# EAGLE schematic main_board (EAGLE 9.6.2)
MLX90640 IR camera
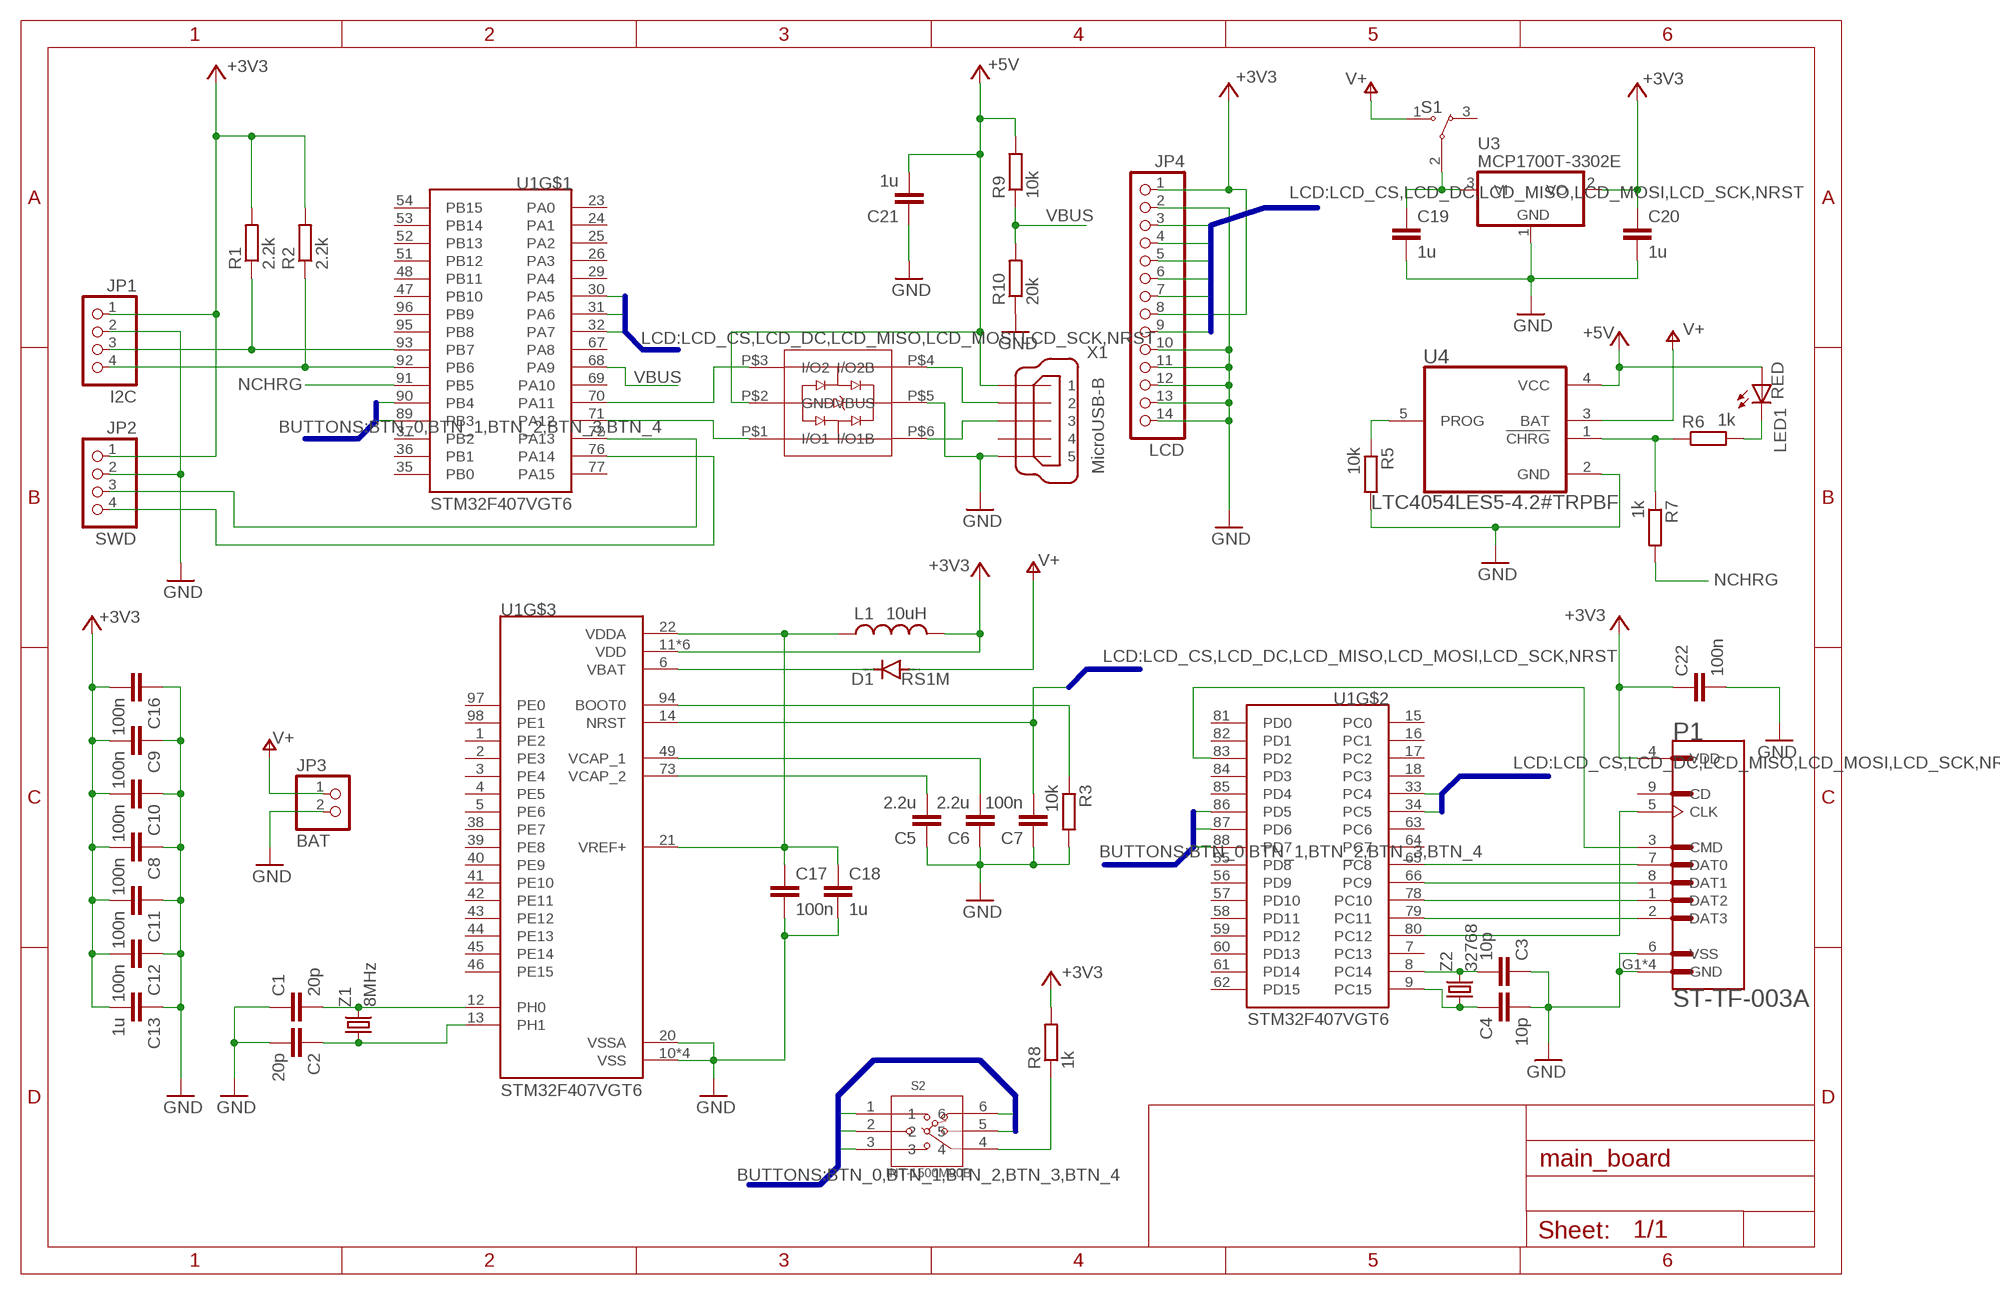
[diagram p0: schematic, sheet 1]

## Parts
C1  20p  C-EUC0805  [C0805]
C2  20p  C-EUC0805  [C0805]
C3  10p  C-EUC0805  [C0805]
C4  10p  C-EUC0805  [C0805]
C5  2.2u  C-EUC0805  [C0805]
C6  2.2u  C-EUC0805  [C0805]
C7  100n  C-EUC0805  [C0805]
C8  100n  C-EUC0805  [C0805]
C9  100n  C-EUC0805  [C0805]
C10  100n  C-EUC0805  [C0805]
C11  100n  C-EUC0805  [C0805]
C12  100n  C-EUC0805  [C0805]
C13  1u  C-EUC0805  [C0805]
C16  100n  C-EUC0805  [C0805]
C17  100n  C-EUC0805  [C0805]
C18  1u  C-EUC0805  [C0805]
C19  1u  C-EUC0805  [C0805]
C20  1u  C-EUC0805  [C0805]
C21  1u  C-EUC0805  [C0805]
C22  100n  C-EUC0805  [C0805]
D1  RS1M  DIODE-DO-214AC  [DO-214AC]
JP1  I2C  PINHD-1X4  [1X04]
JP2  SWD  PINHD-1X4  [1X04]
JP3  BAT  PINHD-1X2  [1X02]
JP4  LCD  PINHD-1X14  [1X14]
L1  10uH  L-USL2012C  [L2012C]
LED1  RED  LEDCHIP-LED0805  [CHIP-LED0805]
P1  ST-TF-003A  [SUNTECH_ST-TF-003A]
R1  2.2k  R-EU_R0805  [R0805]
R2  2.2k  R-EU_R0805  [R0805]
R3  10k  R-EU_R0805  [R0805]
R5  10k  R-EU_R0805  [R0805]
R6  1k  R-EU_R0805  [R0805]
R7  1k  R-EU_R0805  [R0805]
R8  1k  R-EU_R0805  [R0805]
R9  10k  R-EU_R0805  [R0805]
R10  20k  R-EU_R0805  [R0805]
S1  SSA12G  [SW_SSA12G]
S2  INT-1500M90B  SMD-BUTTON(6P-10X10X8.6MM)-SKQUDBE010  [SW6-3.25-10X10X8.6MM]
U1  STM32F407VGT6  [QFP50P1600X1600X160-100N]
U2  USBLC6-2  [SOT-23-6L]
U3  MCP1700T-3302E  MCP1703CB  [SOT23]
U4  LTC4054LES5-4.2#TRPBF  [SOT95P280X100-5N]
X1  MicroUSB-B  MINI-USB-32005-201  [32005-201]
Z1  8MHz  CRYSTALHC49UP  [HC49UP]
Z2  32768  CRYSTALTC38H  [TC38H]

## Nets
+5V [power]: C21.2 LED1.A R9.2 U2.P$2(GND) U4.4(VCC) X1.1
BOOT0: R3.1 U1.94(BOOT0)
BTN_0: S2.6 U1.90(PB4)
BTN_1: S2.1 U1.89(PB3)
BTN_2: S2.5 U1.88(PD7)
BTN_3: S2.3 U1.87(PD6)
BTN_4: S2.2 U1.86(PD5)
BTN_COM: R8.1 S2.4
D+: U2.P$6(I/O1B) X1.3
D+_PROT: U1.71(PA12) U2.P$1(I/O1)
D-: U2.P$4(I/O2B) X1.2
D-_INT: U1.70(PA11) U2.P$3(I/O2)
GND [power]: C1.1 C2.2 C3.1 C4.2 C5.1 C6.1 C7.1 C8.1 C9.1 C10.1 C11.1 C12.1 C13.1 C16.1 C17.2 C18.2 C19.2 C20.2 C21.1 C22.2 JP1.2 JP2.2 JP3.2 JP4.2 JP4.10 JP4.11 JP4.12 JP4.13 JP4.14 P1.6(VSS) P1.G1(GND) P1.G2(GND) P1.G3(GND) P1.G4(GND) R3.2 R5.2 R10.1 U1.10(VSS) U1.20(VSSA) U1.27(VSS) U1.74(VSS) U1.99(VSS) U2.P$5(VBUS) U3.1(GND) U4.2(GND) X1.5
I2C_SCL: JP1.4 R2.1 U1.92(PB6)
I2C_SDA: JP1.3 R1.1 U1.93(PB7)
LCD_CS: JP4.3 U1.33(PC4)
LCD_DC: JP4.5 U1.34(PC5)
LCD_MISO: JP4.9 U1.31(PA6)
LCD_MOSI: JP4.6 U1.32(PA7)
LCD_SCK: JP4.7 U1.30(PA5)
N$1: C1.2 U1.12(PH0) Z1.2
N$2: C2.1 U1.13(PH1) Z1.1
N$3: C4.1 U1.9(PC15) Z2.1
N$5: C6.2 U1.49(VCAP_1)
N$6: C5.2 U1.73(VCAP_2)
N$7: C19.1 S1.2 U3.3(VI)
N$8: R6.1 R7.1 U4.1(!CHRG)
N$9: LED1.C R6.2
N$10: D1.C U1.6(VBAT)
N$11: C3.2 U1.8(PC14) Z2.2
NCHRG: R7.2 U1.91(PB5)
NRST: C7.2 JP4.4 U1.14(NRST)
PROG: R5.1 U4.5(PROG)
SD_CLK: P1.5(CLK) U1.80(PC12)
SD_CMD: P1.3(CMD) U1.83(PD2)
SD_DAT0: P1.7(DAT0) U1.65(PC8)
SD_DAT1: P1.8(DAT1) U1.66(PC9)
SD_DAT2: P1.1(DAT2) U1.78(PC10)
SD_DAT3: P1.2(DAT3) U1.79(PC11)
SWCLK: JP2.4 U1.76(PA14)
SWDIO: JP2.3 U1.72(PA13)
VBAT+ [power]: D1.A JP3.1 S1.1 U4.3(BAT) ; supply symbol labelled V+
VBUS: R9.1 R10.2 U1.68(PA9)
VDD [power]: C8.2 C9.2 C10.2 C11.2 C12.2 C13.2 C16.2 C20.1 C22.1 JP1.1 JP2.1 JP4.1 JP4.8 L1.2 P1.4(VDD) R1.2 R2.2 R8.2 U1.11(VDD) U1.19(VDD) U1.28(VDD) U1.50(VDD) U1.75(VDD) U1.100(VDD) U3.2(VO) ; supply symbol labelled +3V3
VDDA [power]: C17.1 C18.1 L1.1 U1.21(VREF+) U1.22(VDDA)
Unconnected: P1.9(CD) S1.3 U1.1(PE2) U1.2(PE3) U1.3(PE4) U1.4(PE5) U1.5(PE6) U1.7(PC13) U1.15(PC0) U1.16(PC1) U1.17(PC2) U1.18(PC3) U1.23(PA0) U1.24(PA1) U1.25(PA2) U1.26(PA3) U1.29(PA4) U1.35(PB0) U1.36(PB1) U1.37(PB2) U1.38(PE7) U1.39(PE8) U1.40(PE9) U1.41(PE10) U1.42(PE11) U1.43(PE12) U1.44(PE13) U1.45(PE14) U1.46(PE15) U1.47(PB10) U1.48(PB11) U1.51(PB12) U1.52(PB13) U1.53(PB14) U1.54(PB15) U1.55(PD8) U1.56(PD9) U1.57(PD10) U1.58(PD11) U1.59(PD12) U1.60(PD13) U1.61(PD14) U1.62(PD15) U1.63(PC6) U1.64(PC7) U1.67(PA8) U1.69(PA10) U1.77(PA15) U1.81(PD0) U1.82(PD1) U1.84(PD3) U1.85(PD4) U1.95(PB8) U1.96(PB9) U1.97(PE0) U1.98(PE1) X1.4

## Buses
LCD:LCD_CS,LCD_DC,LCD_MISO,LCD_MOSI,LCD_SCK,NRST
BUTTONS:BTN_0,BTN_1,BTN_2,BTN_3,BTN_4

## Library data of the parts
C1-C13 C16-C22 = rcl:C-EU: CAPACITOR, European symbol; SPICEPREFIX: C
D1 = diode:DIODE-: DIODE
JP1 JP2 = pinhead:PINHD-1X4: PIN HEADER
JP3 = pinhead:PINHD-1X2: PIN HEADER
JP4 = pinhead:PINHD-1X14: PIN HEADER
L1 = rcl:L-US: INDUCTOR, American symbol; SPICEPREFIX: L
LED1 = adafruit:LED: LED OSRAM: - CHIPLED LG R971, LG N971, LY N971, LG Q971, LY Q971, LO R971, LY R971 LH N974, LH R974 LS Q976, LO Q976, LY Q976 LO Q996 - Hyper CHIPLED LW Q18S LB Q993, LB Q99A, LB R99A - SideLED LS A670, LO A670, LY A670, LG A670, LP A670 LB A673, LV A673, LT A673, LW A673 LH A674 LY A675 LS A676, LA A676, LO A676, LY A676, LW A676 LS A679, LY A679, LG A679 - Hyper Micro SIDELED® LS Y876, LA Y876, LO Y876, LY Y876 LT Y87S - SmartLED LW L88C, LW L88S LB L89C, LB L89S, LG L890 LS L89K, LO L89K, LY L89K LS L896, LA L896, LO L896, LY L896 - TOPLED LS T670, LO T670, LY T670, LG T670, LP T670 LSG T670, LSP T670, LSY T670, LOP T670, LYG T670 LG T671, LOG T671, LSG T671 LB T673, LV T673, LT T673, LW T673 LH T674 LS T676, LA T676, LO T676, LY T676, LB T676, LH T676, LSB T676, LW T676 LB T67C, LV T67C, LT T67C, LS T67K, LO T67K, LY T67K, LW E67C LS E67B, LA E67B, LO E67B, LY E67B, LB E67C, LV E67C, LT E67C LW T67C LS T679, LY T679, LG T679 LS T770, LO T770, LY T770, LG T770, LP T770 LB T773, LV T773, LT T773, LW T773 LH T774 LS E675, LA E675, LY E675, LS T675 LS T776, LA T776, LO T776, LY T776, LB T776 LHGB T686 LT T68C, LB T68C - Hyper Mini TOPLED® LB M676 - Mini TOPLED Santana® LG M470 LS M47K, LO M47K, LY M47K Source: http://www.osram.convergy.de/
P1 = ST-TF-003A:ST-TF-003A: Micro SD Card Socket Check availability <https://pricing.snapeda.com/parts/ST-TF-003A/Suntech/view-part?ref=eda>; AVAILABILITY: Not in stock; DESCRIPTION: Micro SD Card Socket; MF: Suntech; MP: ST-TF-003A; PACKAGE: None; PRICE: None
R1-R3 R5-R10 = rcl:R-EU_: RESISTOR, European symbol; SPICEPREFIX: R
S1 = SSA12G:SSA12G: 2 Position SPDT Extended Top Actuator Through Hole Vertical Mount Slide Switch Check availability <https://pricing.snapeda.com/parts/SSA12G/TE%20Connectivity/view-part?ref=eda>; AVAILABILITY: In Stock; COMMENT: 1-1437575-5; DESCRIPTION: 2 Position SPDT Extended Top Actuator Through Hole Vertical Mount Slide Switch; MF: TE Connectivity; MP: SSA12G; PACKAGE: None; PRICE: None
S2 = int-1500m90b:SMD-BUTTON(6P-10X10X8.6MM): 311110002 Check availability <https://pricing.snapeda.com/parts/SKQUDBE010/ALPS/view-part?ref=eda>; AVAILABILITY: Not in stock; DESCRIPTION: Switch Tactile Square Plunger J-Bend 0.05A 12VDC 3.14N SMD T/R; MF: ALPS; MP: SKQUDBE010; PACKAGE: None; PRICE: None
U1 = STM32F407VGT6:STM32F407VGT6: STM32 Series 32-bit 1 MB Flash 192 kB RAM ARM Based Microcontroller - LQFP-100 Check availability <https://pricing.snapeda.com/parts/STM32F407VGT6/STMicroelectronics/view-part?ref=eda>; AVAILABILITY: In Stock; DESCRIPTION: ARM® Cortex®-M4 STM32F4 Microcontroller IC 32-Bit 168MHz 1MB (1M x 8) FLASH 100-LQFP (14x14); MF: STMicroelectronics; MP: STM32F407VGT6; PACKAGE: LQFP-100 STMicroelectronics; PRICE: None; PURCHASE-URL: https://pricing.snapeda.com/search/part/STM32F407VGT6/?ref=eda
U2 = USBLC6-2:USBLC6-2: USBLC6-2 Check availability <https://pricing.snapeda.com/parts/USBLC6-2/STMicroelectronics/view-part?ref=eda>; AVAILABILITY: In Stock; DESCRIPTION: 17V Clamp 5A (8/20µs) Ipp Tvs Diode Surface Mount SOT-23-6; MF: STMicroelectronics; MP: USBLC6-2; PACKAGE: SOT-563 STMicroelectronics; PRICE: None; PURCHASE-URL: https://pricing.snapeda.com/search/part/USBLC6-2/?ref=eda
U3 = linear:MCP1703: 250 mA, 16V, Low Quiescent Current LDO Regulator Source: http://ww1.microchip.com/downloads/en/DeviceDoc/22049b.pdf
U4 = LTC4054LES5-4.2_TRPBF:LTC4054LES5-4.2#TRPBF: LTC4054L-4.2 - 150mA Standalone Linear Li-Ion Battery Charger in ThinSOT Check availability <https://pricing.snapeda.com/parts/LTC4054LES5-4.2%23TRPBF/Analog%20Devices/view-part?ref=eda>; AVAILABILITY: In Stock; DESCRIPTION: Battery Charger Li-Ion 10mA to 150mA 4.2V 5-Pin TSOT-23 T/R; MF: Analog Devices; MP: LTC4054LES5-4.2#TRPBF; PACKAGE: SOT-5 Analog Devices; PRICE: None; PURCHASE-URL: https://pricing.snapeda.com/search/part/LTC4054LES5-4.2#TRPBF/?ref=eda
X1 = con-cypressindustries:MINI-USB-: MINI USB-B Conector Source: www.cypressindustries.com; OC_FARNELL: unknown; OC_NEWARK: unknown
Z1 Z2 = crystal:CRYSTAL: CRYSTAL; OC_FARNELL: unknown; OC_NEWARK: unknown

## Net classes
0 default: width 0.3 mm, drill 0.9 mm
1 power: width 0.3 mm, drill 1 mm